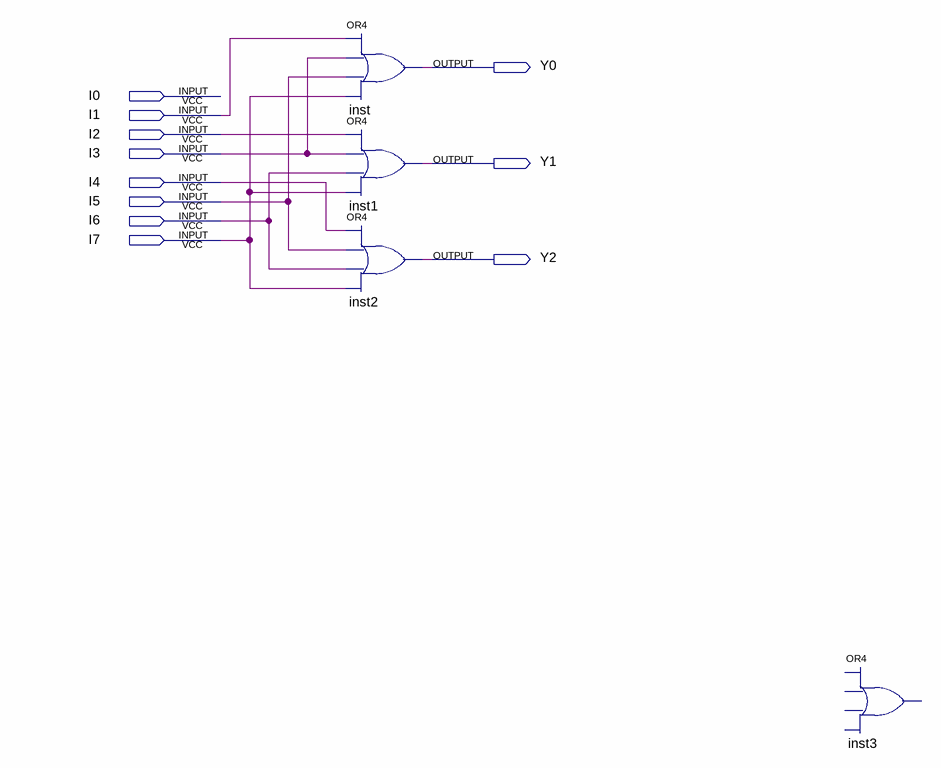
[diagram p0: schematic sheet]
// Quartus schematic 8x3_encoder.bdf as structural Verilog: 4 symbols, 11 pins
module \8x3_encoder  (
  input  I0,
  input  I1,
  input  I2,
  input  I3,
  input  I4,
  input  I5,
  input  I6,
  input  I7,
  output Y0,
  output Y1,
  output Y2
);

  or inst (Y0, I1, I3, I5, I7);
  or inst1 (Y1, I2, I3, I6, I7);
  or inst2 (Y2, I4, I5, I6, I7);
  // OR4 inst3 is placed but not wired
endmodule
